# Altium schematic sheet 原理图.SchDoc
size A4
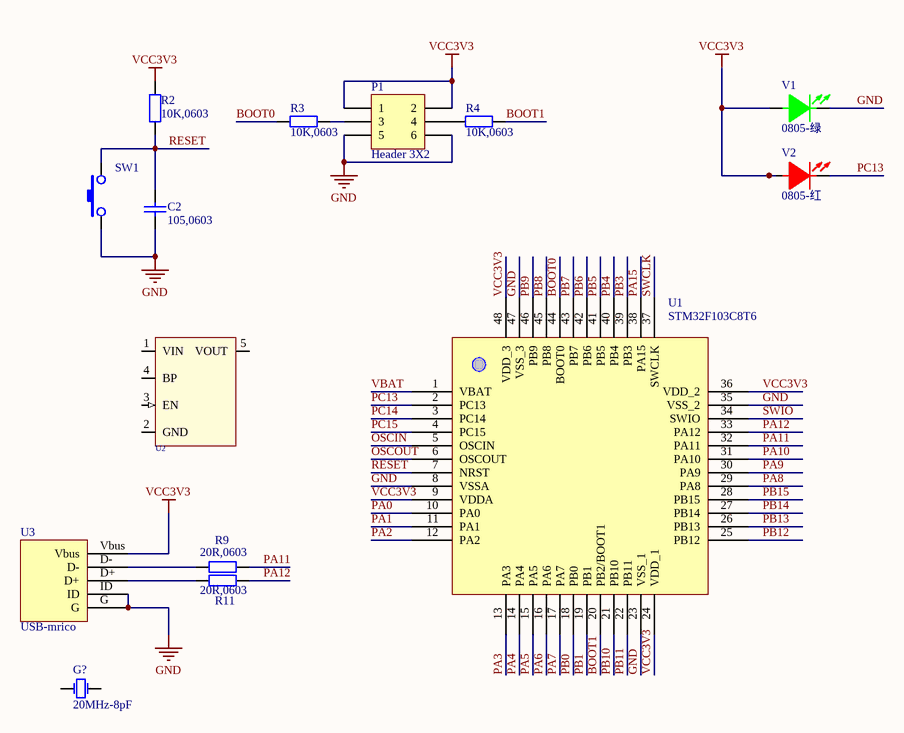
[diagram p0: 原理图.SchDoc]

## Parts
C2  105,0603  [C0603]
G?  value 20MHz-8pF  [XTL-HC49S-SMD-2P]  (hidden comment: 20MHz-8pF-20ppm/HC49S-SMD/明德亨)
P1  Header 3X2  [HDR2X3]
R2  10K,0603  [R0603]
R3  10K,0603  [R0603]
R4  10K,0603  [R0603]
R9  20R,0603  [R0603]
R11  20R,0603  [R0603]
SW1  (no value)  [KEY-SMT]
U1  STM32F103C8T6  [48P]
U2  RT9193  [SOT-23-5]  (value not drawn)
U3  USB-mrico  [Micro_USB]
V1  value 0805-绿  [LED0805-G]  (hidden comment: WZYG0805-DTZ(绿/片式/70mcd))
V2  value 0805-红  [LED0805-R]  (hidden comment: FSL-R2210040HR-TNWSD(红/片式/112mcd))

## Nets
GND: C2.1 P1.5 P1.6 SW1.1 U1.8(VSSA) U1.23(VSS_1) U1.35(VSS_2) U1.47(VSS_3) U3.G U3.ID V1.K
VCC3V3: P1.1 P1.2 R2.2 U1.9(VDDA) U1.24(VDD_1) U1.36(VDD_2) U1.48(VDD_3) U3.Vbus V1.A V2.A
BOOT0: R3.1 U1.44(BOOT0)
BOOT1: R4.2 U1.20(PB2/BOOT1)
OSCIN: U1.5(OSCIN)
OSCOUT: U1.6(OSCOUT)
PA0: U1.10(PA0)
PA1: U1.11(PA1)
PA2: U1.12(PA2)
PA3: U1.13(PA3)
PA4: U1.14(PA4)
PA5: U1.15(PA5)
PA6: U1.16(PA6)
PA7: U1.17(PA7)
PA8: U1.29(PA8)
PA9: U1.30(PA9)
PA10: U1.31(PA10)
PA11: R9.1 U1.32(PA11)
PA12: R11.1 U1.33(PA12)
PA15: U1.38(PA15)
PB0: U1.18(PB0)
PB1: U1.19(PB1)
PB3: U1.39(PB3)
PB4: U1.40(PB4)
PB5: U1.41(PB5)
PB6: U1.42(PB6)
PB7: U1.43(PB7)
PB8: U1.45(PB8)
PB9: U1.46(PB9)
PB10: U1.21(PB10)
PB11: U1.22(PB11)
PB12: U1.25(PB12)
PB13: U1.26(PB13)
PB14: U1.27(PB14)
PB15: U1.28(PB15)
PC13: U1.2(PC13) V2.K
PC14: U1.3(PC14)
PC15: U1.4(PC15)
RESET: C2.2 R2.1 SW1.2 U1.7(NRST)
SWCLK: U1.37(SWCLK)
SWIO: U1.34(SWIO)
VBAT: U1.1(VBAT)
NetP1_3: P1.3 R3.2
NetP1_4: P1.4 R4.1
NetR9_2: R9.2 U3.D-
NetR11_2: R11.2 U3.D+

Not connected (* = marked no-connect by the designer): G? 1(OSC1) 2(OSC2); U2 1(VIN) 2(GND) 3(EN) 4(BP) 5(VOUT)

## Library data of the parts
C2 = Cap: Capacitor; Value: 104; Published: 8-Jun-2000; LatestRevisionDate: 17-Jul-2002; LatestRevisionNote: Re-released for DXP Platform.; Publisher: Altium Limited
G? = 3060110011: 物料名称: 无源晶振; 制造商: 烟台明德亨电子科技有限公司; 标称频率: 20MHz; 频率容限Δf/f(ppm): 20; 负载电容(pF): 8; 晶振类型: 无源; Latest Revision Date: 20210728; Material Code: 3060110011; 代理商: 烟台明德亨电子科技有限公司; 封装形式: HC49S-SMD
P1 = Header 3X2: Header, 3-Pin, Dual row; LatestRevisionDate: 17-Jul-2002; LatestRevisionNote: Re-released for DXP Platform.; Publisher: Altium Limited
R2-R4 R9 R11 = Res2: Resistor; Published: 8-Jun-2000; LatestRevisionDate: 17-Jul-2002; LatestRevisionNote: Re-released for DXP Platform.; Publisher: Altium Limited
SW1 = SW-PB_V: SWITCH
U2 = RT9193X_5P: ICA_MFR_NAME: RICHTEK; ICA_PARTNUM: $$2191094$$RT9193-15CU5; Part Number: TMP-13
U3 = usb-STM
V1 = 3041000169: 物料名称: 发光二极管; 制造商: 珠海市万州光电科技有限公司; 正向电压VF(V): 1.8; 正向测试电流IF(mA): 30; 最大正向电流IFM(mA): 0; 发光强度LI@IF(mcd): 70; 发光颜色: 绿; 形状结构: 片式; Latest Revision Date: 20210805; Material Code: 3041000169; 代理商: 珠海市万州光电科技有限公司
V2 = 3040110122: 物料名称: 发光二极管; 制造商: 苏州市悠越电子有限公司; 代理商: 杭州超视科技有限公司; 正向电压VF(V): 1.8; 正向测试电流IF(mA): 20; 最大正向电流IFM(mA): 0; 发光强度LI@IF(mcd): 112; 发光颜色: 红; 形状结构: 片式; Latest Revision Date: 20210805; Material Code: 3040110122